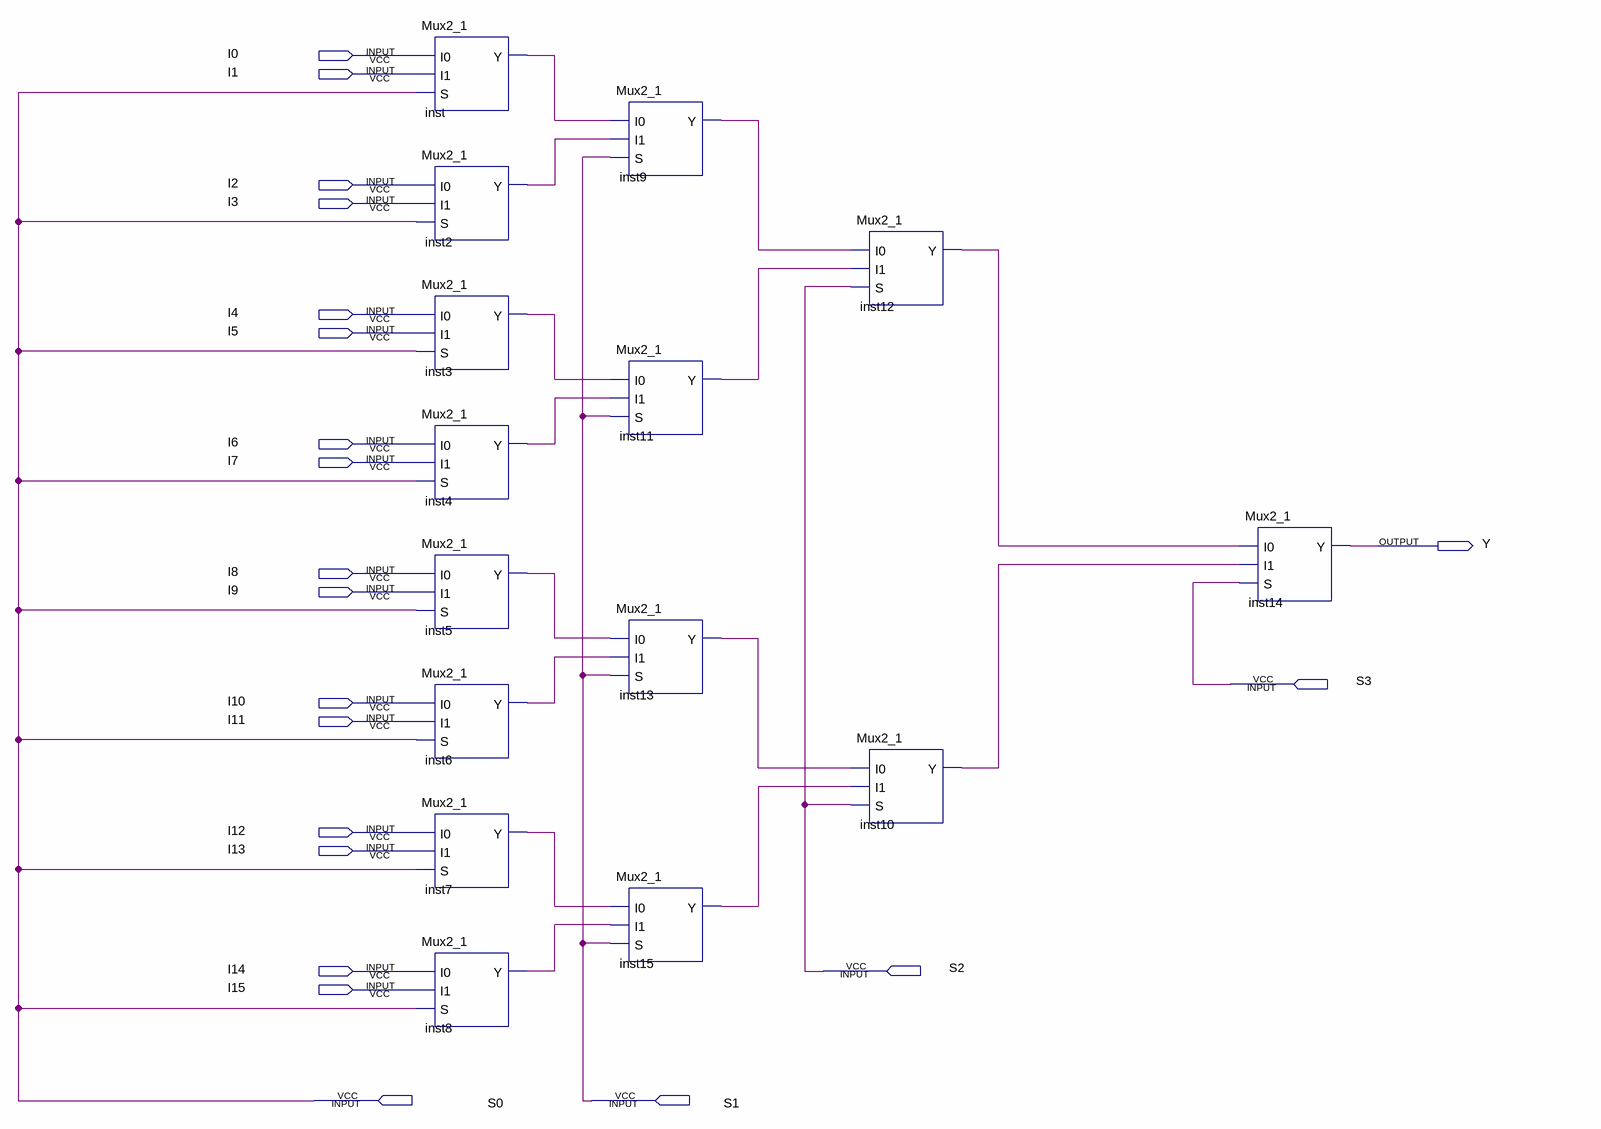
[diagram p0: schematic sheet]
// Quartus schematic Mux16_1.bdf as structural Verilog: 15 symbols, 21 pins
module Mux16_1 (
  input  I0,
  input  I1,
  input  I2,
  input  I3,
  input  I4,
  input  I5,
  input  I6,
  input  I7,
  input  I8,
  input  I9,
  input  S3,
  input  I10,
  input  I11,
  input  I12,
  input  I13,
  input  I14,
  input  S2,
  input  I15,
  input  S0,
  input  S1,
  output Y
);

  wire inst2_y, inst3_y, inst4_y, inst5_y, inst6_y, inst7_y, inst8_y, inst9_y, inst10_y, inst11_y, inst12_y,
       inst13_y, inst15_y, inst_y;

  Mux2_1 inst (.I0(I0), .I1(I1), .S(S0), .Y(inst_y));
  Mux2_1 inst2 (.I0(I2), .I1(I3), .S(S0), .Y(inst2_y));
  Mux2_1 inst3 (.I0(I4), .I1(I5), .S(S0), .Y(inst3_y));
  Mux2_1 inst4 (.I0(I6), .I1(I7), .S(S0), .Y(inst4_y));
  Mux2_1 inst5 (.I0(I8), .I1(I9), .S(S0), .Y(inst5_y));
  Mux2_1 inst6 (.I0(I10), .I1(I11), .S(S0), .Y(inst6_y));
  Mux2_1 inst7 (.I0(I12), .I1(I13), .S(S0), .Y(inst7_y));
  Mux2_1 inst8 (.I0(I14), .I1(I15), .S(S0), .Y(inst8_y));
  Mux2_1 inst9 (.I0(inst_y), .I1(inst2_y), .S(S1), .Y(inst9_y));
  Mux2_1 inst11 (.I0(inst3_y), .I1(inst4_y), .S(S1), .Y(inst11_y));
  Mux2_1 inst13 (.I0(inst5_y), .I1(inst6_y), .S(S1), .Y(inst13_y));
  Mux2_1 inst15 (.I0(inst7_y), .I1(inst8_y), .S(S1), .Y(inst15_y));
  Mux2_1 inst12 (.I0(inst9_y), .I1(inst11_y), .S(S2), .Y(inst12_y));
  Mux2_1 inst10 (.I0(inst13_y), .I1(inst15_y), .S(S2), .Y(inst10_y));
  Mux2_1 inst14 (.I0(inst12_y), .I1(inst10_y), .S(S3), .Y(Y));
endmodule
